# Altium schematic sheet MainCtrl A6 Pro.SchDoc
size A2
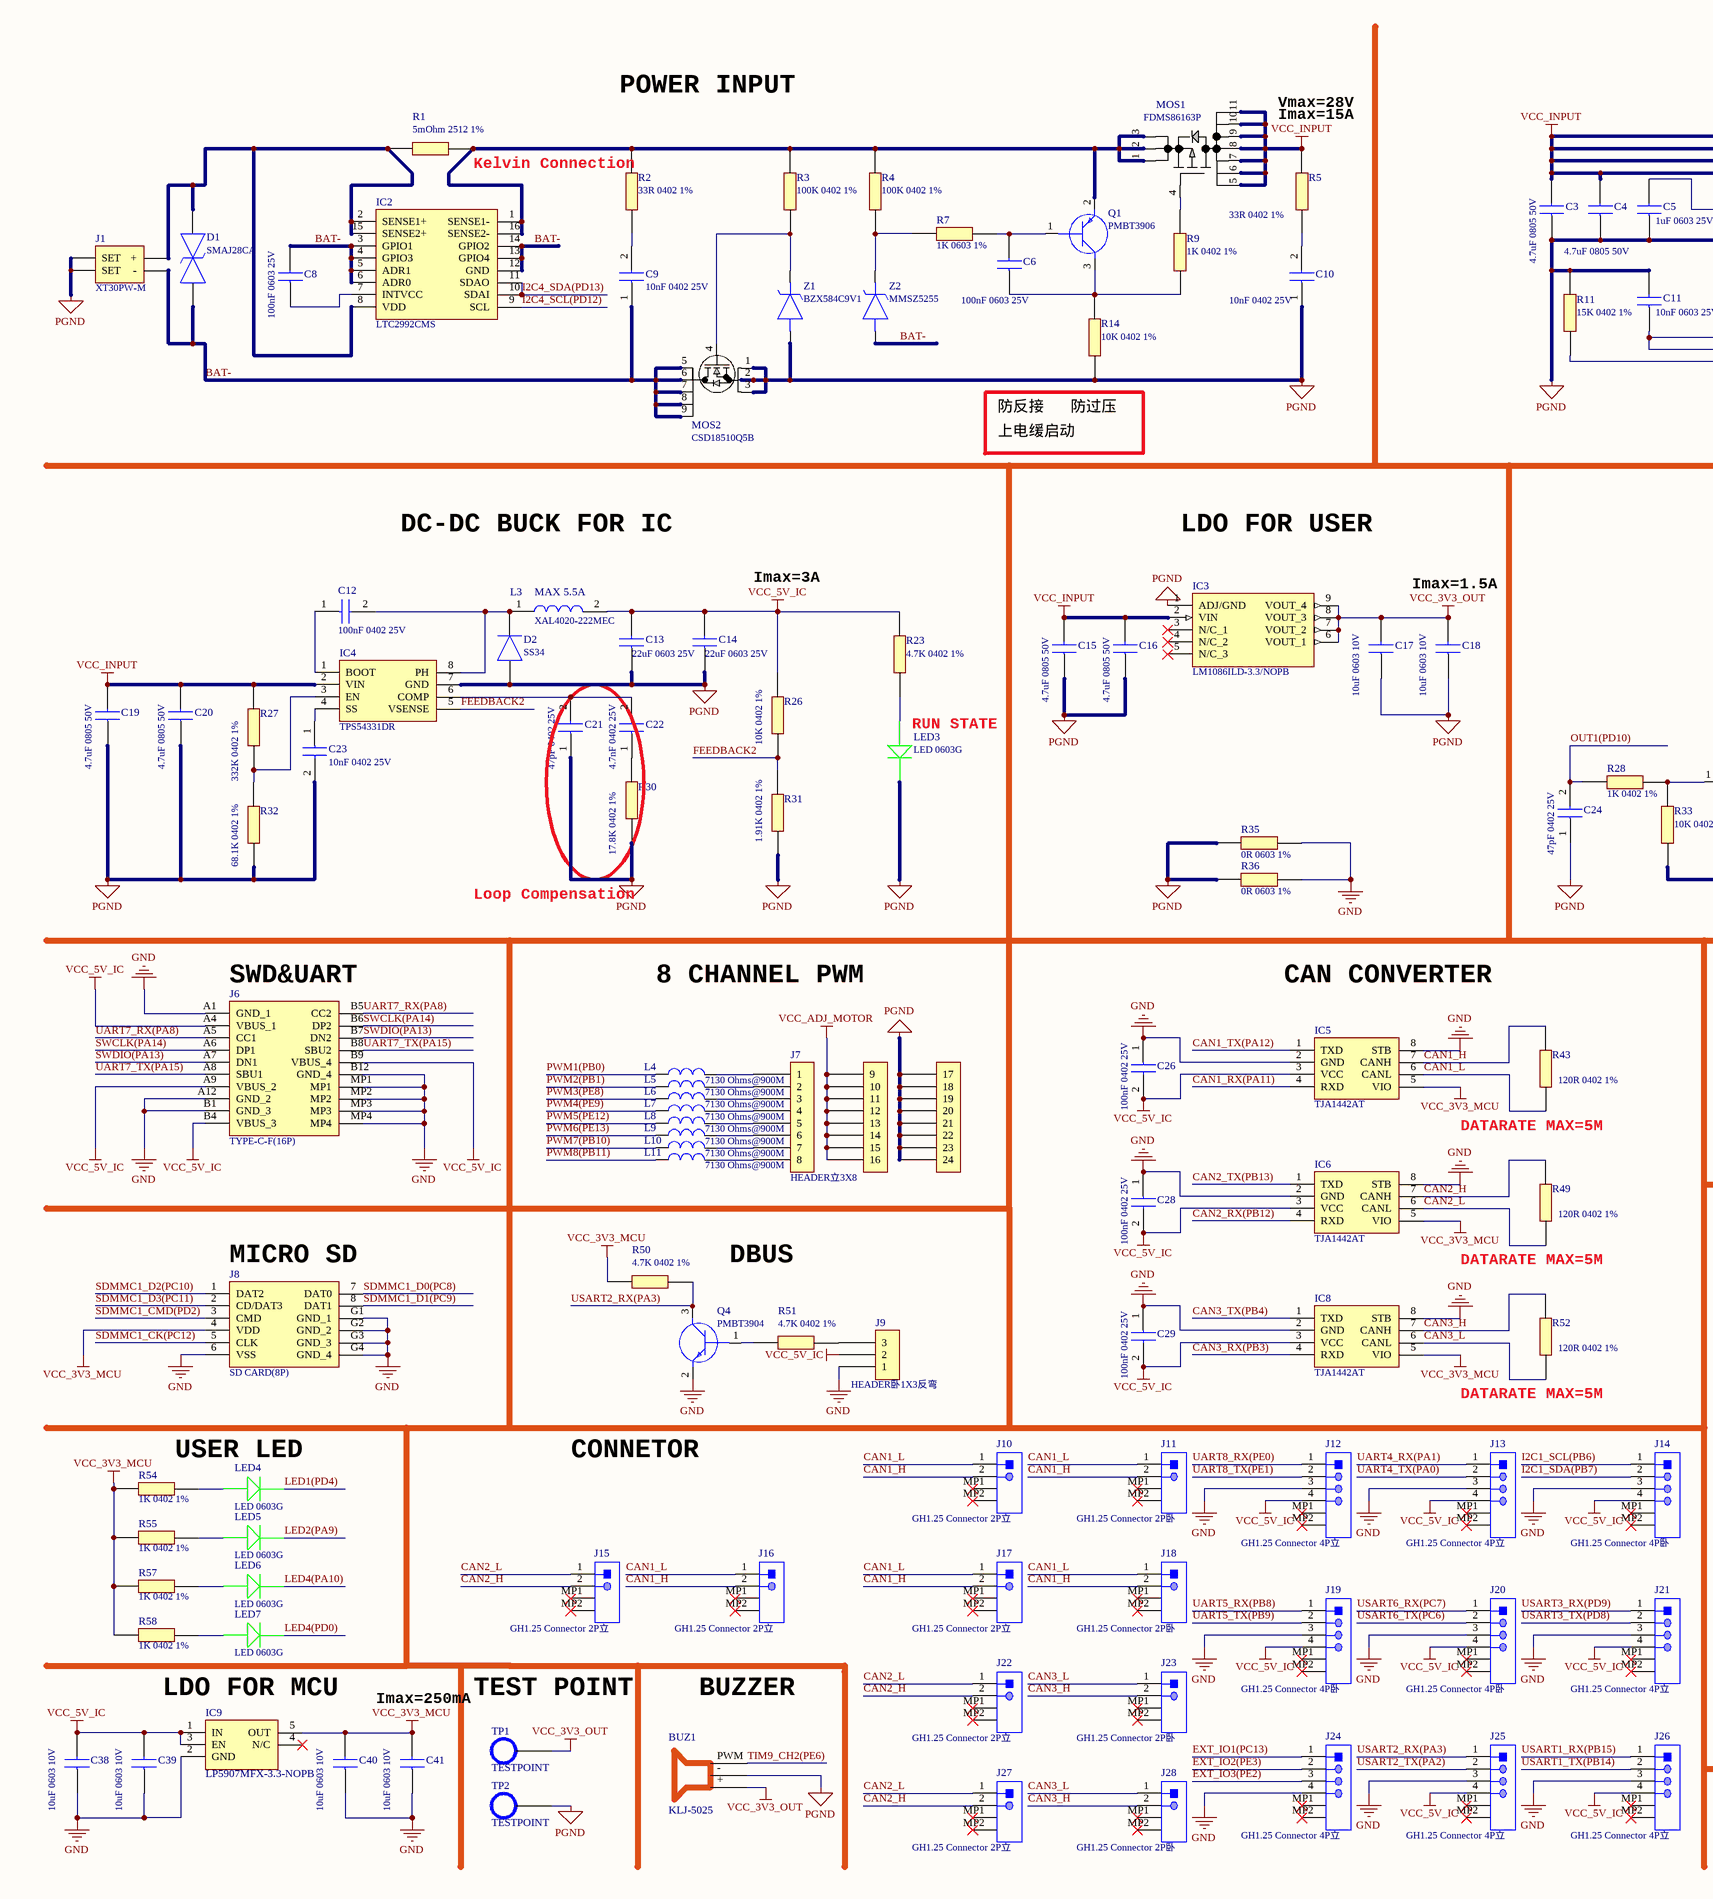
[diagram p0: MainCtrl A6 Pro.SchDoc, left]
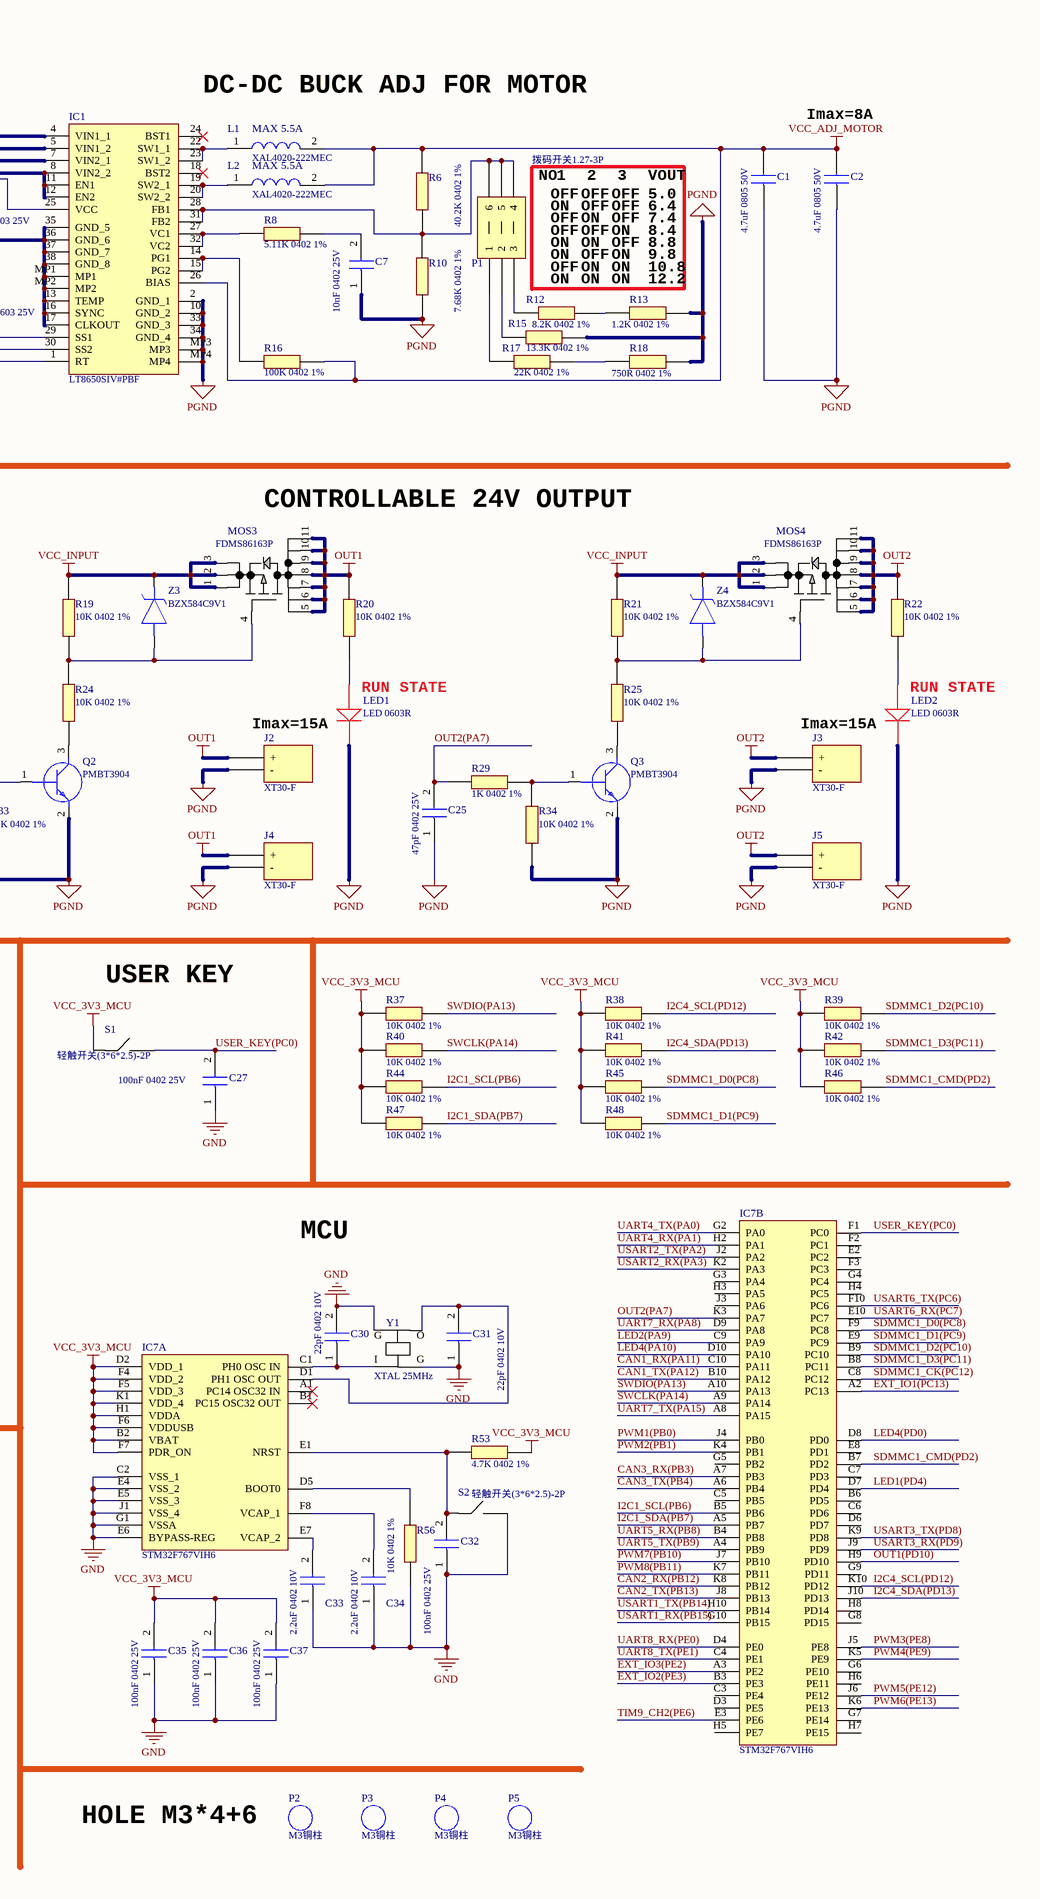
[diagram p1: MainCtrl A6 Pro.SchDoc, right]

## Parts
BUZ1  KLJ-5025  [KLJ-5025]
C1  4.7uF 0805 50V  [C0805]
C2  4.7uF 0805 50V  [C0805]
C3  4.7uF 0805 50V  [C0805]
C4  4.7uF 0805 50V  [C0805]
C5  1uF 0603 25V  [C0603]
C6  100nF 0603 25V  [C0603]
C7  10nF 0402 25V  [C0402]
C8  100nF 0603 25V  [C0603]
C9  10nF 0402 25V  [C0402]
C10  10nF 0402 25V  [C0402]
C11  10nF 0603 25V  [C0603]
C12  100nF 0402 25V  [C0402]
C13  22uF 0603 25V  [C0603]
C14  22uF 0603 25V  [C0603]
C15  4.7uF 0805 50V  [C0805]
C16  4.7uF 0805 50V  [C0805]
C17  10uF 0603 10V  [C0603]
C18  10uF 0603 10V  [C0603]
C19  4.7uF 0805 50V  [C0805]
C20  4.7uF 0805 50V  [C0805]
C21  47pF 0402 25V  [C0402]
C22  4.7nF 0402 25V  [C0402]
C23  10nF 0402 25V  [C0402]
C24  47pF 0402 25V  [C0402]
C25  47pF 0402 25V  [C0402]
C26  100nF 0402 25V  [C0402]
C27  100nF 0402 25V  [C0402]
C28  100nF 0402 25V  [C0402]
C29  100nF 0402 25V  [C0402]
C30  22pF 0402 10V  [C0402]
C31  22pF 0402 10V  [C0402]
C32  100nF 0402 25V  [C0402]
C33  2.2uF 0402 10V  [C0402]
C34  2.2uF 0402 10V  [C0402]
C35  100nF 0402 25V  [C0402]
C36  100nF 0402 25V  [C0402]
C37  100nF 0402 25V  [C0402]
C38  10uF 0603 10V  [C0603]
C39  10uF 0603 10V  [C0603]
C40  10uF 0603 10V  [C0603]
C41  10uF 0603 10V  [C0603]
D1  SMAJ28CA  [SMAJ28CA]
D2  SS34  [SS34]
IC1  LT8650SIV#PBF  [LT8650SEV#PBF]
IC2  LTC2992CMS  [LTC2992CMS]
IC3  LM1086ILD-3.3/NOPB  [LM1086ILD-3.3]
IC4  TPS54331DR  [TPS54331DR]
IC5  TJA1442AT  [TJA1442AT]
IC6  TJA1442AT  [TJA1442AT]
IC7  STM32F767VIH6  [STM32F767VIH6]  (parts A,B of 2)
IC8  TJA1442AT  [TJA1442AT]
IC9  LP5907MFX-3.3-NOPB  [LP5907MFX-3.3]
J1  XT30PW-M  [XT30PW-M]
J2  XT30-F  [XT30-F]
J3  XT30-F  [XT30-F]
J4  XT30-F  [XT30-F]
J5  XT30-F  [XT30-F]
J6  TYPE-C-F(16P)  [TYPE-C-F(16P)]
J7  HEADER立3X8  [Header立3X8]
J8  SD CARD(8P)  [SD CARD(8P)]
J9  HEADER卧1X3反弯  [Header卧1X3反弯]
J10  GH1.25 Connector 2P立  [GH1.25立2P]
J11  GH1.25 Connector 2P卧  [GH1.25卧2P]
J12  GH1.25 Connector 4P立  [GH1.25立4P]
J13  GH1.25 Connector 4P立  [GH1.25立4P]
J14  GH1.25 Connector 4P卧  [GH1.25卧4P]
J15  GH1.25 Connector 2P立  [GH1.25立2P]
J16  GH1.25 Connector 2P立  [GH1.25立2P]
J17  GH1.25 Connector 2P立  [GH1.25立2P]
J18  GH1.25 Connector 2P卧  [GH1.25卧2P]
J19  GH1.25 Connector 4P卧  [GH1.25卧4P]
J20  GH1.25 Connector 4P卧  [GH1.25卧4P]
J21  GH1.25 Connector 4P立  [GH1.25立4P]
J22  GH1.25 Connector 2P立  [GH1.25立2P]
J23  GH1.25 Connector 2P卧  [GH1.25卧2P]
J24  GH1.25 Connector 4P立  [GH1.25立4P]
J25  GH1.25 Connector 4P立  [GH1.25立4P]
J26  GH1.25 Connector 4P立  [GH1.25立4P]
J27  GH1.25 Connector 2P立  [GH1.25立2P]
J28  GH1.25 Connector 2P卧  [GH1.25卧2P]
L1  XAL4020-222MEC  [XAL4020]
L2  XAL4020-222MEC  [XAL4020]
L3  XAL4020-222MEC  [XAL4020]
L4  7130 Ohms@900M  [0402DF]
L5  7130 Ohms@900M  [0402DF]
L6  7130 Ohms@900M  [0402DF]
L7  7130 Ohms@900M  [0402DF]
L8  7130 Ohms@900M  [0402DF]
L9  7130 Ohms@900M  [0402DF]
L10  7130 Ohms@900M  [0402DF]
L11  7130 Ohms@900M  [0402DF]
LED1  LED 0603R  [LED 0603R]
LED2  LED 0603R  [LED 0603R]
LED3  LED 0603G  [LED 0603G]
LED4  LED 0603G  [LED 0603G]
LED5  LED 0603G  [LED 0603G]
LED6  LED 0603G  [LED 0603G]
LED7  LED 0603G  [LED 0603G]
MOS1  FDMS86163P  [FDMS86163P]
MOS2  CSD18510Q5B  [CSD18510Q5B]
MOS3  FDMS86163P  [FDMS86163P]
MOS4  FDMS86163P  [FDMS86163P]
P1  拨码开关1.27-3P  [拨码开关1.27-3P]
P2  M3铜柱  [M3x4+6铜柱]
P3  M3铜柱  [M3x4+6铜柱]
P4  M3铜柱  [M3x4+6铜柱]
P5  M3铜柱  [M3x4+6铜柱]
Q1  PMBT3906  [PMBT3906]
Q2  PMBT3904  [PMBT3904]
Q3  PMBT3904  [PMBT3904]
Q4  PMBT3904  [PMBT3904]
R1  5mOhm 2512 1%  [R2512]
R2  33R 0402 1%  [R0402]
R3  100K 0402 1%  [R0402]
R4  100K 0402 1%  [R0402]
R5  33R 0402 1%  [R0402]
R6  40.2K 0402 1%  [R0402]
R7  1K 0603 1%  [R0603]
R8  5.11K 0402 1%  [R0402]
R9  1K 0402 1%  [R0402]
R10  7.68K 0402 1%  [R0402]
R11  15K 0402 1%  [R0402]
R12  8.2K 0402 1%  [R0402]
R13  1.2K 0402 1%  [R0402]
R14  10K 0402 1%  [R0402]
R15  13.3K 0402 1%  [R0402]
R16  100K 0402 1%  [R0402]
R17  22K 0402 1%  [R0402]
R18  750R 0402 1%  [R0402]
R19  10K 0402 1%  [R0402]
R20  10K 0402 1%  [R0402]
R21  10K 0402 1%  [R0402]
R22  10K 0402 1%  [R0402]
R23  4.7K 0402 1%  [R0402]
R24  10K 0402 1%  [R0402]
R25  10K 0402 1%  [R0402]
R26  10K 0402 1%  [R0402]
R27  332K 0402 1%  [R0402]
R28  1K 0402 1%  [R0402]
R29  1K 0402 1%  [R0402]
R30  17.8K 0402 1%  [R0402]
R31  1.91K 0402 1%  [R0402]
R32  68.1K 0402 1%  [R0402]
R33  10K 0402 1%  [R0402]
R34  10K 0402 1%  [R0402]
R35  0R 0603 1%  [R0603]
R36  0R 0603 1%  [R0603]
R37  10K 0402 1%  [R0402]
R38  10K 0402 1%  [R0402]
R39  10K 0402 1%  [R0402]
R40  10K 0402 1%  [R0402]
R41  10K 0402 1%  [R0402]
R42  10K 0402 1%  [R0402]
R43  120R 0402 1%  [R0402]
R44  10K 0402 1%  [R0402]
R45  10K 0402 1%  [R0402]
R46  10K 0402 1%  [R0402]
R47  10K 0402 1%  [R0402]
R48  10K 0402 1%  [R0402]
R49  120R 0402 1%  [R0402]
R50  4.7K 0402 1%  [R0402]
R51  4.7K 0402 1%  [R0402]
R52  120R 0402 1%  [R0402]
R53  4.7K 0402 1%  [R0402]
R54  1K 0402 1%  [R0402]
R55  1K 0402 1%  [R0402]
R56  10K 0402 1%  [R0402]
R57  1K 0402 1%  [R0402]
R58  1K 0402 1%  [R0402]
S1  轻触开关(3*6*2.5)-2P  [轻触开关(3*6*2.5)-2P]
S2  轻触开关(3*6*2.5)-2P  [轻触开关(3*6*2.5)-2P]
TP1  TESTPOINT  [TESTPOINT]
TP2  TESTPOINT  [TESTPOINT]
Y1  XTAL 25MHz  [XTAL25MHz 3225]
Z1  BZX584C9V1  [BZX584C9V1]
Z2  MMSZ5255  [MMSZ5255]
Z3  BZX584C9V1  [BZX584C9V1]
Z4  BZX584C9V1  [BZX584C9V1]

## Nets
GND: C26.1 C27.1 C28.1 C29.1 C30.2 C31.1 C32.1 C33.1 C34.1 C35.1 C36.1 C37.1 C38.1 C39.1 C40.1 C41.1 IC5.2(GND) IC5.8(STB) IC6.2(GND) IC6.8(STB) IC7.C2(VSS_1) IC7.E4(VSS_2) IC7.E5(VSS_3) IC7.E6(BYPASS-REG) IC7.G1(VSSA) IC7.J1(VSS_4) IC8.2(GND) IC8.8(STB) IC9.2(GND) J6.A1(GND_1) J6.A12(GND_2) J6.B1(GND_3) J6.B12(GND_4) J6.MP1 J6.MP2 J6.MP3 J6.MP4 J8.6(VSS) J8.G1(GND_1) J8.G2(GND_2) J8.G3(GND_3) J8.G4(GND_4) J9.1 J12.3 J13.3 J14.3 J19.3 J20.3 J21.3 J24.4 J25.3 J26.3 Q4.2(E) R35.2 R36.2 R56.1 S2.2 Y1.2 Y1.4
OUT1: J2.1(+) J4.1(+) MOS3.5(D) MOS3.6(D) MOS3.7(D) MOS3.8(D) MOS3.9(D) MOS3.10(D) MOS3.11(D) R20.1
OUT2: J3.1(+) J5.1(+) MOS4.5(D) MOS4.6(D) MOS4.7(D) MOS4.8(D) MOS4.9(D) MOS4.10(D) MOS4.11(D) R22.1
PGND: BUZ1.2 C1.1 C2.1 C3.1 C4.1 C5.1 C7.1 C10.1 C11.2 C13.1 C14.1 C15.1 C16.1 C17.1 C18.1 C19.1 C20.1 C21.1 C23.2 C24.1 C25.1 D2.2(A) IC1.2(GND_1) IC1.10(GND_2) IC1.13(TEMP) IC1.16(SYNC) IC1.17(CLKOUT) IC1.33(GND_3) IC1.34(GND_4) IC1.35(GND_5) IC1.36(GND_6) IC1.37(GND_7) IC1.38(GND_8) IC1.MP1 IC1.MP2 IC1.MP3 IC1.MP4 IC3.1(ADJ/GND) IC4.7(GND) J1.3(SET) J1.4(SET) J2.2(-) J3.2(-) J4.2(-) J5.2(-) J7.17 J7.18 J7.19 J7.20 J7.21 J7.22 J7.23 J7.24 LED1.2 LED2.2 LED3.2 MOS2.1(S) MOS2.2(S) MOS2.3(S) Q2.2(E) Q3.2(E) R10.2 R11.1 R13.2 R14.1 R15.2 R18.2 R30.1 R31.1 R32.1 R33.2 R34.2 R35.1 R36.1 TP2.1 Z1.2
VCC_3V3_MCU: C35.2 C36.2 C37.2 C40.2 C41.2 IC5.5(VIO) IC6.5(VIO) IC7.B2(VBAT) IC7.D2(VDD_1) IC7.F4(VDD_2) IC7.F5(VDD_3) IC7.F6(VDDUSB) IC7.F7(PDR_ON) IC7.H1(VDDA) IC7.K1(VDD_4) IC8.5(VIO) IC9.5(OUT) J8.4(VDD) R37.2 R38.2 R39.2 R40.2 R41.2 R42.2 R44.2 R45.2 R46.2 R47.2 R48.2 R50.2 R53.2 R54.1 R55.1 R57.1 R58.1 S1.1
VCC_3V3_OUT: BUZ1.1 C17.2 C18.2 IC3.6(VOUT_1) IC3.7(VOUT_2) IC3.8(VOUT_3) IC3.9(VOUT_4) TP1.1
VCC_5V_IC: C13.2 C14.2 C26.2 C28.2 C29.2 C38.2 C39.2 IC5.3(VCC) IC6.3(VCC) IC8.3(VCC) IC9.1(IN) IC9.3(EN) J6.A4(VBUS_1) J6.A9(VBUS_2) J6.B4(VBUS_3) J6.B9(VBUS_4) J9.2 J12.4 J13.4 J14.4 J19.4 J20.4 J21.4 J25.4 J26.4 L3.2 R23.1 R26.2
VCC_ADJ_MOTOR: C1.2 C2.2 IC1.26(BIAS) J7.9 J7.10 J7.11 J7.12 J7.13 J7.14 J7.15 J7.16 L1.2 L2.2 R6.1 R16.2
VCC_INPUT: C3.2 C4.2 C15.2 C16.2 C19.2 C20.2 IC1.4(VIN1_1) IC1.5(VIN1_2) IC1.7(VIN2_1) IC1.8(VIN2_2) IC1.11(EN1) IC1.12(EN2) IC3.2(VIN) IC4.2(VIN) MOS1.5(D) MOS1.6(D) MOS1.7(D) MOS1.8(D) MOS1.9(D) MOS1.10(D) MOS1.11(D) MOS3.1 MOS3.2 MOS3.3 MOS4.1 MOS4.2 MOS4.3 R5.2 R19.1 R21.1 R27.2 Z3.1 Z4.1
BAT-: C8.2 C9.1 D1.1 IC2.3(GPIO1) IC2.4(GPIO3) IC2.5(ADR1) IC2.6(ADR0) IC2.12(GND) IC2.13(GPIO4) IC2.14(GPIO2) J1.2(-) MOS2.5(D) MOS2.6(D) MOS2.7(D) MOS2.8(D) MOS2.9(D) Z2.2(A)
CAN1_H: IC5.7(CANH) J10.2 J11.2 J16.2 J17.2 J18.2 R43.2
CAN1_L: IC5.6(CANL) J10.1 J11.1 J16.1 J17.1 J18.1 R43.1
CAN1_RX(PA11): IC5.4(RXD) IC7.C10(PA11)
CAN1_TX(PA12): IC5.1(TXD) IC7.B10(PA12)
CAN2_H: IC6.7(CANH) J15.2 J22.2 J27.2 R49.2
CAN2_L: IC6.6(CANL) J15.1 J22.1 J27.1 R49.1
CAN2_RX(PB12): IC6.4(RXD) IC7.K8(PB12)
CAN2_TX(PB13): IC6.1(TXD) IC7.J8(PB13)
CAN3_H: IC8.7(CANH) J23.2 J28.2 R52.2
CAN3_L: IC8.6(CANL) J23.1 J28.1 R52.1
CAN3_RX(PB3): IC7.A7(PB3) IC8.4(RXD)
CAN3_TX(PB4): IC7.A6(PB4) IC8.1(TXD)
EXT_IO1(PC13): IC7.A2(PC13) J24.1
EXT_IO2(PE3): IC7.B3(PE3) J24.2
EXT_IO3(PE2): IC7.A3(PE2) J24.3
FEEDBACK2: IC4.5(VSENSE) R26.1 R31.2
I2C1_SCL(PB6): IC7.B5(PB6) J14.1 R44.1
I2C1_SDA(PB7): IC7.A5(PB7) J14.2 R47.1
I2C4_SCL(PD12): IC2.9(SCL) IC7.K10(PD12) R38.1
I2C4_SDA(PD13): IC2.10(SDAI) IC2.11(SDAO) IC7.J10(PD13) R41.1
LED1(PD4): IC7.D7(PD4) LED4.2
LED2(PA9): IC7.C9(PA9) LED5.2
LED4(PA10): IC7.D10(PA10) LED6.2
LED4(PD0): IC7.D8(PD0) LED7.2
OUT1(PD10): C24.2 IC7.H9(PD10) R28.2
OUT2(PA7): C25.2 IC7.K3(PA7) R29.2
PWM1(PB0): IC7.J4(PB0) L4.1
PWM2(PB1): IC7.K4(PB1) L5.1
PWM3(PE8): IC7.J5(PE8) L6.1
PWM4(PE9): IC7.K5(PE9) L7.1
PWM5(PE12): IC7.J6(PE12) L8.1
PWM6(PE13): IC7.K6(PE13) L9.1
PWM7(PB10): IC7.J7(PB10) L10.1
PWM8(PB11): IC7.K7(PB11) L11.1
SDMMC1_CK(PC12): IC7.C8(PC12) J8.5(CLK)
SDMMC1_CMD(PD2): IC7.B7(PD2) J8.3(CMD) R46.1
SDMMC1_D0(PC8): IC7.F9(PC8) J8.7(DAT0) R45.1
SDMMC1_D1(PC9): IC7.E9(PC9) J8.8(DAT1) R48.1
SDMMC1_D2(PC10): IC7.B9(PC10) J8.1(DAT2) R39.1
SDMMC1_D3(PC11): IC7.B8(PC11) J8.2(CD/DAT3) R42.1
SWCLK(PA14): IC7.A9(PA14) J6.A6(DP1) J6.B6(DP2) R40.1
SWDIO(PA13): IC7.A10(PA13) J6.A7(DN1) J6.B7(DN2) R37.1
TIM9_CH2(PE6): BUZ1.3 IC7.E3(PE6)
UART4_RX(PA1): IC7.H2(PA1) J13.1
UART4_TX(PA0): IC7.G2(PA0) J13.2
UART5_RX(PB8): IC7.B4(PB8) J19.1
UART5_TX(PB9): IC7.A4(PB9) J19.2
UART7_RX(PA8): IC7.D9(PA8) J6.A5(CC1) J6.B5(CC2)
UART7_TX(PA15): IC7.A8(PA15) J6.A8(SBU1) J6.B8(SBU2)
UART8_RX(PE0): IC7.D4(PE0) J12.1
UART8_TX(PE1): IC7.C4(PE1) J12.2
USART1_RX(PB15): IC7.G10(PB15) J26.1
USART1_TX(PB14): IC7.H10(PB14) J26.2
USART2_RX(PA3): IC7.K2(PA3) J25.1 Q4.3(C) R50.1
USART2_TX(PA2): IC7.J2(PA2) J25.2
USART3_RX(PD9): IC7.J9(PD9) J21.1
USART3_TX(PD8): IC7.K9(PD8) J21.2
USART6_RX(PC7): IC7.E10(PC7) J20.1
USART6_TX(PC6): IC7.F10(PC6) J20.2
USER_KEY(PC0): C27.2 IC7.F1(PC0) S1.2
NetC5_2: C5.2 IC1.25(VCC)
NetC6_1: C6.1 Q1.3(C) R9.1 R14.2
NetC6_2: C6.2 Q1.1(B) R7.2
NetC7_2: C7.2 R8.2
NetC8_1: C8.1 IC2.7(INTVCC)
NetC9_2: C9.2 R2.1
NetC10_2: C10.2 R5.1
NetC11_1: C11.1 IC1.29(SS1) IC1.30(SS2)
NetC12_1: C12.1 IC4.1(BOOT)
NetC12_2: C12.2 D2.1(K) IC4.8(PH) L3.1
NetC21_2: C21.2 C22.2 IC4.6(COMP)
NetC22_1: C22.1 R30.2
NetC23_1: C23.1 IC4.4(SS)
NetC30_1: C30.1 IC7.C1(PH0_OSC_IN) Y1.1
NetC31_2: C31.2 IC7.D1(PH1_OSC_OUT) Y1.3
NetC32_2: C32.2 IC7.E1(NRST) R53.1 S2.1
NetC33_2: C33.2 IC7.E7(VCAP_2)
NetC34_2: C34.2 IC7.F8(VCAP_1)
NetD1_2: D1.2 IC2.2(SENSE1+) IC2.8(VDD) IC2.15(SENSE2+) J1.1(+) R1.1
NetIC1_1: IC1.1(RT) R11.2
NetIC1_14: IC1.14(PG1) IC1.15(PG2) R16.1
NetIC1_19: IC1.19(SW2_1) IC1.20(SW2_2) L2.1
NetIC1_22: IC1.22(SW1_1) IC1.23(SW1_2) L1.1
NetIC1_27: IC1.27(VC1) IC1.32(VC2) R8.1
NetIC1_28: IC1.28(FB1) IC1.31(FB2) P1.4 P1.5 P1.6 R6.2 R10.1
NetIC2_1: IC2.1(SENSE1-) IC2.16(SENSE2-) MOS1.1 MOS1.2 MOS1.3 Q1.2(E) R1.2 R2.2 R3.2 R4.2
NetIC4_3: IC4.3(EN) R27.1 R32.2
NetIC7_D5: IC7.D5(BOOT0) R56.2
NetJ7_1: J7.1 L4.2
NetJ7_2: J7.2 L5.2
NetJ7_3: J7.3 L6.2
NetJ7_4: J7.4 L7.2
NetJ7_5: J7.5 L8.2
NetJ7_6: J7.6 L9.2
NetJ7_7: J7.7 L10.2
NetJ7_8: J7.8 L11.2
NetJ9_3: J9.3 R51.1
NetLED1_1: LED1.1 R20.2
NetLED2_1: LED2.1 R22.2
NetLED3_1: LED3.1 R23.2
NetLED4_1: LED4.1 R54.2
NetLED5_1: LED5.1 R55.2
NetLED6_1: LED6.1 R57.2
NetLED7_1: LED7.1 R58.2
NetMOS1_4: MOS1.4 R9.2
NetMOS2_4: MOS2.4(G) R3.1 Z1.1
NetMOS3_4: MOS3.4 R19.2 R24.1 Z3.2
NetMOS4_4: MOS4.4 R21.2 R25.1 Z4.2
NetP1_1: P1.1 R17.1
NetP1_2: P1.2 R15.1
NetP1_3: P1.3 R12.1
NetQ2_1: Q2.1(B) R28.1 R33.1
NetQ2_3: Q2.3(C) R24.2
NetQ3_1: Q3.1(B) R29.1 R34.1
NetQ3_3: Q3.3(C) R25.2
NetQ4_1: Q4.1(B) R51.2
NetR4_1: R4.1 R7.1 Z2.1(K)
NetR12_2: R12.2 R13.1
NetR17_2: R17.2 R18.1

Not connected (* = marked no-connect by the designer): IC1 18(BST2)* 24(BST1)*; IC3 3(N/C_1)* 4(N/C_2)* 5(N/C_3)*; IC7 A1(PC14_OSC32_IN)* B1(PC15_OSC32_OUT)* B6(PD5) C3(PE4) C5(PB5) C6(PD6) C7(PD3) D3(PE5) D6(PD7) E2(PC2) E8(PD1) F2(PC1) F3(PC3) G3(PA4) G4(PC4) G5(PB2) G6(PE10) G7(PE14) G8(PD15) G9(PD11) H3(PA5) H4(PC5) H5(PE7) H6(PE11) H7(PE15) H8(PD14) J3(PA6); IC9 4(N/C)*; J10 MP1* MP2*; J11 MP1* MP2*; J12 MP1* MP2*; J13 MP1* MP2*; J14 MP1* MP2*; J15 MP1* MP2*; J16 MP1* MP2*; J17 MP1* MP2*; J18 MP1* MP2*; J19 MP1* MP2*; J20 MP1* MP2*; J21 MP1* MP2*; J22 MP1* MP2*; J23 MP1* MP2*; J24 MP1* MP2*; J25 MP1* MP2*; J26 MP1* MP2*; J27 MP1* MP2*; J28 MP1* MP2*

## Notes on the sheet
- POWER INPUT
- DC-DC BUCK ADJ FOR MOTOR
- (near MOS1) Vmax=28V
- Imax=15A
- Imax=8A
- Kelvin Connection
- (near P1) NO
- (near P1) OFF
- (near P1) ON
- (near P1) 1
- OFF
- ON
- 2
- 3
- VOUT
- 5.0
- 6.4
- 7.4
- 8.4
- 8.8
- 9.8
- (near R13) 10.8
- (near R13) ON
- (near R13) 12.2
- 防反接
- 上电缓启动
- (near R14) 防过压
- (near MOS3) CONTROLLABLE 24V OUTPUT
- DC-DC BUCK FOR IC
- Imax=3A
- LDO FOR USER
- Imax=1.5A
- (near LED1) RUN STATE
- (near LED2) RUN STATE
- (near LED3) RUN STATE
- Loop Compensation
- (near J6) SWD&UART
- 8 CHANNEL PWM
- CAN CONVERTER
- USER KEY
- DATARATE MAX=5M
- MCU
- (near J8) MICRO SD
- DBUS
- (near R52) DATARATE MAX=5M
- USER LED
- CONNETOR
- LDO FOR MCU
- Imax=250mA
- TEST POINT
- BUZZER
- HOLE M3*4+6
- (in symbol KLJ-5025) PWM; -; +
- (in symbol XAL4020-222MEC) MAX 5.5A
- (in symbol XTAL 25MHz) G; O; I

## Library data of the parts
BUZ1 = KLJ-5025: Buzzer
C1-C4 C15 C16 C19 C20 = C0805: Capacitor; Manufacturer_Name: Walsin Technology Corporation; Manufacturer_Part_Number: 0805B104K500CT; Datasheet Link: https://datasheet.datasheetarchive.com/originals/distributors/DKDS41/DSANUWW0027552.pdf; Height: 0.9mm; Mouser Part Number: 791-0805B104K500CT; Mouser Price/Stock: https://www.mouser.co.uk/ProductDetail/Walsin/0805B104K500CT?qs=fIkAfuXiAQIRyZemBo9ukA%3D%3D; Arrow Part Number: 0805B104K500CT; Arrow Price/Stock: https://www.arrow.com/en/products/0805b104k500ct/walsin-technology
C5 C6 C8 C11 C13 C14 C17 C18 C38-C41 = C0603: Capacitor; Manufacturer_Name: Walsin Technology Corporation; Manufacturer_Part_Number: 0603N470J500CT; Datasheet Link: https://datasheet.datasheetarchive.com/originals/distributors/DKDS41/DSANUWW0027552.pdf; Height: 0.87mm; Mouser Part Number: 791-0603N470J500CT; Mouser Price/Stock: https://www.mouser.co.uk/ProductDetail/Walsin/0603N470J500CT?qs=ZrPdAQfJ6DOWJe9N0xQVbw%3D%3D
C7 C9 C10 C12 C21-C37 = C0402: Capacitor
D1 = SMAJ28CA: TVS Diode (Bi-directional); Manufacturer_Name: Bourns; Datasheet Link: https://www.bourns.com/data/global/pdfs/SMAJ.pdf; Height: 2.62mm; Manufacturer_Part_Number: SMAJ28CA; Mouser Part Number: 652-SMAJ28CA; Mouser Price/Stock: https://www.mouser.co.uk/ProductDetail/Bourns/SMAJ28CA?qs=A3H9pljuJ8Rc2FOBsYvsOw%3D%3D; Arrow Part Number: SMAJ28CA; Arrow Price/Stock: https://www.arrow.com/en/products/smaj28ca/bourns
D2 = SS34: Diode; Manufacturer_Name: Taiwan Semiconductor; Manufacturer_Part_Number: SS34LWHRVG; Datasheet Link: https://datasheet.datasheetarchive.com/originals/distributors/DKDS-20/389381.pdf; Height: 1.02mm; Mouser Part Number: 821-SS34LWHRVG; Mouser Price/Stock: https://www.mouser.co.uk/ProductDetail/Taiwan-Semiconductor/SS34LWHRVG?qs=5aG0NVq1C4zYvYQjFNyRbA%3D%3D; Arrow Part Number: SS34LWHRVG; Arrow Price/Stock: https://www.arrow.com/en/products/ss34lwhrvg/taiwan-semiconductor?region=nac
IC1 = LT8650SIV#PBF: Integrated Circuit; Manufacturer_Name: Analog Devices; Datasheet Link: https://www.arrow.com/en/products/lt8650sivpbf/analog-devices; Height: 1.03mm; Manufacturer_Part_Number: LT8650SIV#PBF; Mouser Part Number: 584-LT8650SIVPBF; Mouser Price/Stock: https://www.mouser.co.uk/ProductDetail/Analog-Devices/LT8650SIVPBF?qs=xhbEVWpZdWcEXgHZH75prQ%3D%3D; Arrow Part Number: LT8650SIV#PBF; Arrow Price/Stock: https://www.arrow.com/en/products/lt8650sivpbf/analog-devices
IC2 = LTC2992CMS: Integrated Circuit; Manufacturer_Name: Linear Technology; Manufacturer_Part_Number: LTC2992CMS#TRPBF; Datasheet Link: https://datasheet.datasheetarchive.com/originals/distributors/DKDS-14/270197.pdf; Height: 1.1mm; Mouser Part Number: 584-LTC2992CMSTRPBF; Mouser Price/Stock: https://www.mouser.com/Search/Refine.aspx?Keyword=584-LTC2992CMSTRPBF
IC3 = LM1086ILD-3.3/NOPB: Integrated Circuit; Manufacturer_Name: Texas Instruments; Datasheet Link: http://www.ti.com/lit/ds/symlink/lm1086.pdf; Height: 0.8mm; Manufacturer_Part_Number: LM1086ILD-3.3/NOPB; Mouser Part Number: 926-LM1086ILD33NOPB; Mouser Price/Stock: https://www.mouser.co.uk/ProductDetail/Texas-Instruments/LM1086ILD-33-NOPB?qs=X1J7HmVL2ZFS9csUZPyAEg%3D%3D; Arrow Part Number: LM1086ILD-3.3/NOPB; Arrow Price/Stock: https://www.arrow.com/en/products/lm1086ild-3.3nopb/texas-instruments?region=nac
IC4 = TPS54331DR: Integrated Circuit; Manufacturer_Name: Texas Instruments; Datasheet Link: http://www.ti.com/lit/gpn/tps54331; Height: 1.75mm; Manufacturer_Part_Number: TPS54331DR; Mouser Part Number: 595-TPS54331DR; Mouser Price/Stock: https://www.mouser.co.uk/ProductDetail/Texas-Instruments/TPS54331DR?qs=QyYHynRG50rsSYcB%2Ftz4Yw%3D%3D; Arrow Part Number: TPS54331DR; Arrow Price/Stock: https://www.arrow.com/en/products/tps54331dr/texas-instruments?region=nac
IC5 IC6 IC8 = TJA1442AT: Integrated Circuit; Manufacturer_Name: NXP; Manufacturer_Part_Number: TJA1442AT/0Z; Datasheet Link: https://www.nxp.com/docs/en/data-sheet/TJR1442.pdf; Height: 1.75mm
IC7 = STM32F767VIH6: Integrated Circuit; Manufacturer_Name: STMicroelectronics; Datasheet Link: https://www.st.com/resource/en/datasheet/stm32f767vi.pdf; Height: 1.1mm; Manufacturer_Part_Number: STM32F767VIH6; Mouser Part Number: 511-STM32F767VIH6; Mouser Price/Stock: https://www.mouser.co.uk/ProductDetail/STMicroelectronics/STM32F767VIH6?qs=5aG0NVq1C4yUww13GyBTYQ%3D%3D; Arrow Part Number: STM32F767VIH6; Arrow Price/Stock: https://www.arrow.com/en/products/stm32f767vih6/stmicroelectronics?region=nac
IC9 = LP5907MFX-3.3-NOPB: Integrated Circuit; Manufacturer_Name: Texas Instruments; Manufacturer_Part_Number: LP5907MFX-3.3/NOPB; Datasheet Link: https://datasheet.datasheetarchive.com/originals/distributors/Datasheets-SFU2/DSASFU100037200.pdf; Height: 1.45mm; Mouser Part Number: 595-LP5907MFX-3.3NPB; Mouser Price/Stock: https://www.mouser.co.uk/ProductDetail/Texas-Instruments/LP5907MFX-33-NOPB?qs=biyDIajrTn6NhrJCoL%2FdSQ%3D%3D; Arrow Part Number: LP5907MFX-3.3/NOPB; Arrow Price/Stock: https://www.arrow.com/en/products/lp5907mfx-3.3nopb/texas-instruments?region=nac
J1 = XT30PW-M: Connector; Manufacturer_Name: Amass; Datasheet Link: https://www.tme.eu/sl/Document/ce4077e36b79046da520ca73227e15de/XT30PW%20SPEC.pdf; Height: 5mm; Manufacturer_Part_Number: XT30PW-M
J2-J5 = XT30-F: Connector
J6 = TYPE-C-F(16P): Connector; Manufacturer_Name: XUNPU; Manufacturer_Part_Number: TYPEC-304S-ACP16; Datasheet Link: https://datasheet.lcsc.com/szlcsc/2008152133_XUNPU-TYPEC-304S-ACP16_C720630.pdf; Height: 3.21mm
J7 = HEADER立3X8: Header
J8 = SD CARD(8P): Connector; Manufacturer_Name: Molex; Manufacturer_Part_Number: 0472192001; Datasheet Link: https://www.molex.com/pdm_docs/sd/472192001_sd.pdf; Height: 1.9mm; Mouser Part Number: N/A; Mouser Price/Stock: https://www.mouser.com/Search/Refine.aspx?Keyword=N%2FA; Arrow Part Number: 0472192001; Arrow Price/Stock: https://www.arrow.com/en/products/0472192001/molex
J9 = HEADER卧1X3反弯: Header
J10 J15-J17 J22 J27 = GH1.25 Connector 2P立: GH1.25 Connector; Manufacturer: JST; No of Positions: 2; Pitch: 1.25mm; Style/Orientation: StraightHeader/Plug; Package Reference: BM02B-GHS-TBT; Type: WiretoBoard; Datasheet URL: http://www.jst-mfg.com/product/pdf/eng/eGH.pdf; Termination: Crimp; Manufacturer URL: http://www.jst.com/home2.html; Mounting Technology: SurfaceMount; Datasheet Version: 05/2016; Package Description: GH Disconnectable Crimp Style Connector, Pitch 1.25 mm, 1 x 2 Position, Height 4.05 mm
J11 J18 J23 J28 = GH1.25 Connector 2P卧: GH1.25 Connector; Manufacturer: JST; No of Positions: 2; Pitch: 1.25mm; Style/Orientation: RightAngleHeader/Plug; Package Reference: SM02B-GHS-TB; Type: WiretoBoard; Datasheet URL: http://www.jst-mfg.com/product/pdf/eng/eGH.pdf; Termination: Crimp; Manufacturer URL: http://www.jst.com/home2.html; Mounting Technology: SurfaceMount; Datasheet Version: 05/2016; Package Description: GH Disconnectable Crimp Style Connector, Pitch 1.25 mm, 1 x 2 Position, Height 4.25 mm
J12 J13 J21 J24-J26 = GH1.25 Connector 4P立: GH1.25 Connector; Manufacturer: JST; No of Positions: 4; Pitch: 1.25mm; Style/Orientation: StraightHeader/Plug; Package Reference: BM04B-GHS-TBT; Type: WiretoBoard; Datasheet URL: http://www.jst-mfg.com/product/pdf/eng/eGH.pdf; Termination: Crimp; Manufacturer URL: http://www.jst.com/home2.html; Mounting Technology: SurfaceMount; Datasheet Version: 05/2016; Package Description: GH Disconnectable Crimp Style Connector, Pitch 1.25 mm, 1 x 4 Position, Height 4.05 mm
J14 J19 J20 = GH1.25 Connector 4P卧: GH1.25 Connector; Manufacturer: JST; No of Positions: 4; Pitch: 1.25mm; Style/Orientation: RightAngleHeader/Plug; Package Reference: SM04B-GHS-TB; Type: WiretoBoard; Datasheet URL: http://www.jst-mfg.com/product/pdf/eng/eGH.pdf; Termination: Crimp; Manufacturer URL: http://www.jst.com/home2.html; Mounting Technology: SurfaceMount; Datasheet Version: 05/2016; Package Description: GH Disconnectable Crimp Style Connector, Pitch 1.25 mm, 1 x 4 Position, Height 4.25 mm
L1-L3 = XAL4020-222MEC: Inductor; Manufacturer_Name: COILCRAFT; Manufacturer_Part_Number: XAL4020-222MEB; Datasheet Link: http://www.coilcraft.com/pdfs/xal4000.pdf; Height: 2.1mm; Mouser Part Number: 994-XAL4020-222MEB; Mouser Price/Stock: https://www.mouser.co.uk/ProductDetail/Coilcraft/XAL4020-222MEB/?qs=VJjuEbE9QBOpgK2Se6TQVQ%3D%3D
L4-L11 = Ferrite Chip Inductors: Inductor 901XJR
LED1 LED2 = LED 0603R: LED Red
LED3-LED7 = LED 0603G: LED Green
MOS1 MOS3 MOS4 = FDMS86163P: MOSFET P-ch; Manufacturer_Name: ON Semiconductor; Manufacturer_Part_Number: FDMS86252; Datasheet Link: https://www.onsemi.com/pdf/datasheet/fdms86252-d.pdf; Height: 1.1mm; Mouser Part Number: 512-FDMS86252; Mouser Price/Stock: https://www.mouser.com/Search/Refine.aspx?Keyword=512-FDMS86252; Arrow Part Number: FDMS86252; Arrow Price/Stock: https://www.arrow.com/en/products/fdms86252/on-semiconductor
MOS2 = CSD18510Q5B: MOSFET N-ch; Manufacturer_Name: Texas Instruments; Manufacturer_Part_Number: CSD18510Q5BT; Datasheet Link: http://www.ti.com/lit/ds/symlink/csd18510q5b.pdf; Mouser Part Number: 595-CSD18510Q5BT; Mouser Price/Stock: https://www.mouser.co.uk/ProductDetail/Texas-Instruments/CSD18510Q5BT?qs=u4fy%2FsgLU9PeKSF3sD%2F9mw%3D%3D; Arrow Part Number: CSD18510Q5BT; Arrow Price/Stock: https://www.arrow.com/en/products/csd18510q5bt/texas-instruments?region=nac
P1 = 拨码开关1.27-3P: Switch
P2-P5 = M3铜柱: Hole M3X4+6
Q1 = PMBT3906: Transistor BJT PNP; Manufacturer_Name: Nexperia; Manufacturer_Part_Number: PMBT3906,235; Datasheet Link: http://assets.nexperia.com/documents/data-sheet/PMBT3906.pdf; Height: 1.1mm; Mouser Part Number: 771-PMBT3906235; Mouser Price/Stock: https://www.mouser.co.uk/ProductDetail/Nexperia/PMBT3906235?qs=LOCUfHb8d9tZESb%2FzqnQ2g%3D%3D; Arrow Part Number: PMBT3906,235; Arrow Price/Stock: https://www.arrow.com/en/products/pmbt3906235/nexperia
Q2-Q4 = PMBT3904: Transistor BJT NPN; Manufacturer_Name: Nexperia; Manufacturer_Part_Number: PMBT3904,215; Datasheet Link: http://assets.nexperia.com/documents/data-sheet/PMBT3904.pdf; Height: 1.1mm; Mouser Part Number: 771-PMBT3904-T/R; Mouser Price/Stock: https://www.mouser.co.uk/ProductDetail/Nexperia/PMBT3904215?qs=LOCUfHb8d9tXximHEgx1nw%3D%3D; Arrow Part Number: PMBT3904,215; Arrow Price/Stock: https://www.arrow.com/en/products/pmbt3904215/nexperia
R1 = R2512: Resistor
R2-R6 R8-R34 R37-R58 = R0402: Resistor; Manufacturer_Name: Bourns; Manufacturer_Part_Number: CR0402; Datasheet Link: https://www.bourns.com/docs/product-datasheets/CRxxxxx.pdf; Height: 0.37mm
R7 R35 R36 = R0603: Resistor; Manufacturer_Name: Bourns; Manufacturer_Part_Number: CR0603-JW-681ELF; Datasheet Link: https://www.bourns.com/pdfs/chpreztr.pdf; Height: 0.55mm; Arrow Part Number: CR0603-JW-681ELF; Arrow Price/Stock: https://www.arrow.com/en/products/cr0603-jw-681elf/bourns
S1 S2 = 轻触开关(3*6*2.5)-2P: Switch
Y1 = XTAL 25MHz: Crystal or Oscillator; Manufacturer_Name: ABRACON; Manufacturer_Part_Number: ABM8AIG-25.000MHZ-12-2Z-T3; Datasheet Link: https://abracon.com/AIGcrystals/ABM8AIG.pdf; Height: 0.8mm; Mouser Part Number: 815-M8AIG-25-12-2ZT3; Mouser Price/Stock: https://www.mouser.co.uk/ProductDetail/ABRACON/ABM8AIG-25000MHZ-12-2Z-T3?qs=gG6m684uYP75Fd4ygmfcRQ%3D%3D; Arrow Part Number: ABM8AIG-25.000MHZ-12-2Z-T3; Arrow Price/Stock: https://www.arrow.com/en/products/abm8aig25.000mhz122zt3/abracon
Z1 Z3 Z4 = BZX584C9V1: Zener Diode; Manufacturer_Name: Vishay; Manufacturer_Part_Number: BZX584C9V1-G3-08; Datasheet Link: https://www.mouser.co.uk/datasheet/2/427/bzx584c-series-1767863.pdf; Height: 0.75mm; Mouser Part Number: 78-BZX584C9V1-G3-08; Mouser Price/Stock: https://www.mouser.co.uk/ProductDetail/Vishay-Semiconductors/BZX584C9V1-G3-08?qs=OTrKUuiFdkYjt7ytUwYykQ%3D%3D
Z2 = MMSZ5255: Zener Diode; Manufacturer_Name: ON Semiconductor; Manufacturer_Part_Number: MMSZ5255BT1G; Datasheet Link: http://www.onsemi.com/pub/Collateral/MMSZ5221BT1-D.PDF; Height: 1.35mm; Mouser Part Number: 863-MMSZ5255BT1G; Mouser Price/Stock: https://www.mouser.co.uk/ProductDetail/ON-Semiconductor/MMSZ5255BT1G?qs=P4IOph%252Bbot%2FgHALVE7f5PQ%3D%3D; Arrow Part Number: MMSZ5255BT1G; Arrow Price/Stock: https://www.arrow.com/en/products/mmsz5255bt1g/on-semiconductor